# EAGLE schematic Hauptplatine (EAGLE 7.1.0)
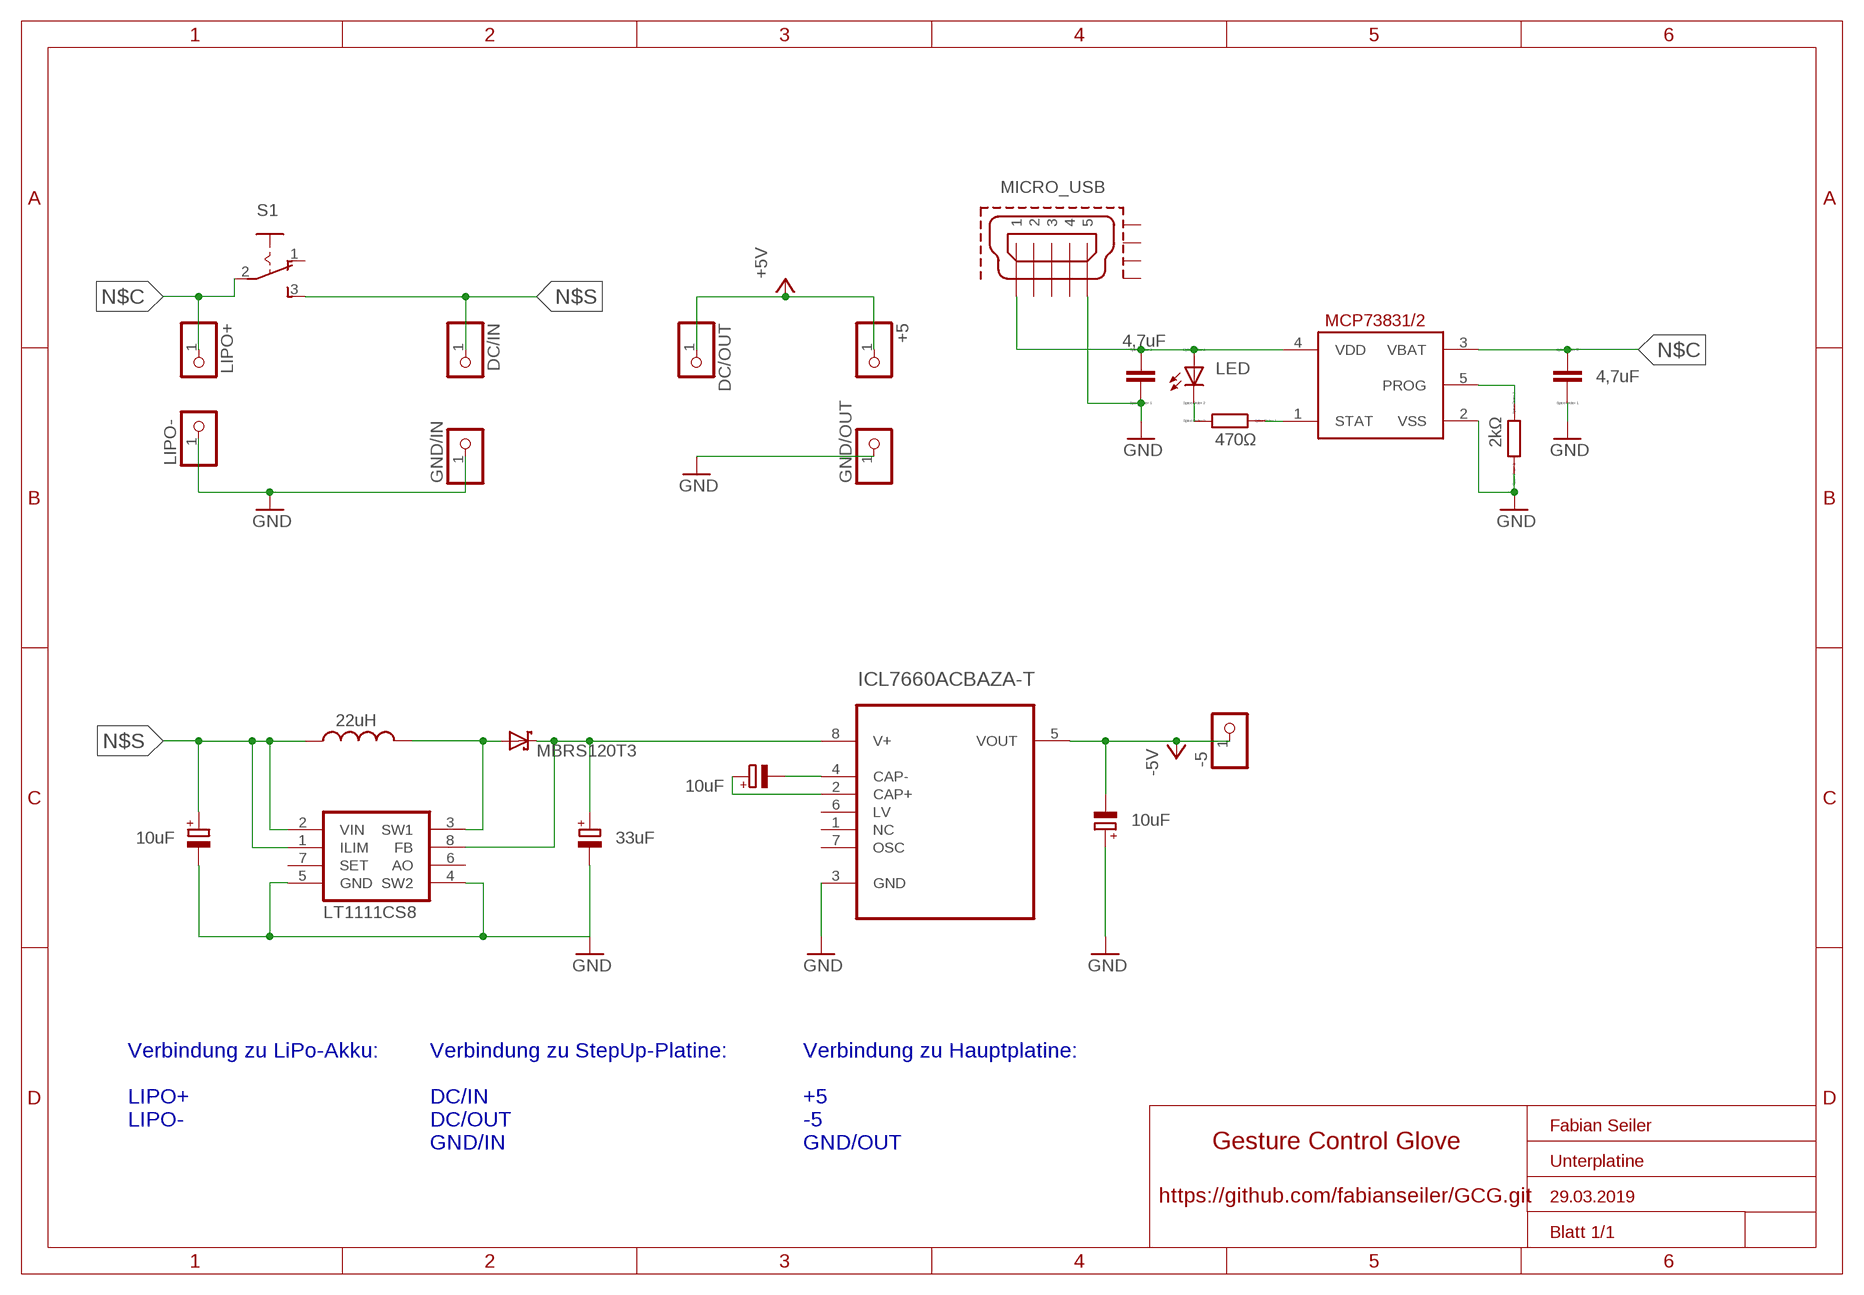
[diagram p0: schematic, sheet 1]

## Parts
+5  PINHD-1X1CB  [1X01-CLEANBIG]
-5  PINHD-1X1CB  [1X01-CLEANBIG]
C_L1  4,7uF  C-EUC0402  [C0402]
C_L2  4,7uF  C-EUC0402  [C0402]
CF3  10uF  CPOL-EU153CLV-0505  [153CLV-0505]
CF4  33uF  CPOL-EU153CLV-0505  [153CLV-0505]
CF5  10uF  CPOL-EU153CLV-0505  [153CLV-0505]
CF6  10uF  CPOL-EU153CLV-0505  [153CLV-0505]
D_PS1  MBRS120T3  [DO214AA]
DC/IN  PINHD-1X1CB  [1X01-CLEANBIG]
DC/OUT  PINHD-1X1CB  [1X01-CLEANBIG]
GND/IN  PINHD-1X1CB  [1X01-CLEANBIG]
GND/OUT  PINHD-1X1CB  [1X01-CLEANBIG]
IC1  MCP73831/OT  [SOT23-5L]
IC3  LT1111CS8  [SO08]
L-242408FPS1  22uH  L-USL2012C  [L2012C]
LED  LED_ESML0603  [LED_SML0603]
LIPO+  PINHD-1X1CB  [1X01-CLEANBIG]
LIPO-  PINHD-1X1CB  [1X01-CLEANBIG]
MICRO_USB  MICRO-USB-RECEPTACLE47589-0001  [47589-0001]
R_BMC  470Ω  R-EU_R0402  [R0402]
R_BMC2  2kΩ  R-EU_R0402  [R0402]
S1  255SB  [255SB]
U1  ICL7660ACBAZA-T  [SOIC127P600X175-8N]

## Nets
+5V: +5.1 DC/OUT.1
-5V: -5.1 CF6.- U1.5(VOUT)
GND: C_L1.1 C_L2.1 CF3.- CF4.- CF6.+ GND/IN.1 GND/OUT.1 IC1.2(VSS) IC3.4(SW2) IC3.5(GND) LIPO-.1 MICRO_USB.5 R_BMC2.1 U1.3(GND)
N$3: CF5.- U1.4(CAP-)
N$4: CF5.+ U1.2(CAP+)
N$24: C_L1.2 IC1.4(VDD) LED.A MICRO_USB.1
N$25: LED.C R_BMC.2
N$26: IC1.1(STAT) R_BMC.1
N$28: IC1.5(PROG) R_BMC2.2
N$69: D_PS1.A IC3.3(SW1) L-242408FPS1.2
N$70: CF4.+ D_PS1.C IC3.8(FB) U1.8(V+)
N$C: C_L2.2 IC1.3(VBAT) LIPO+.1 S1.2(P)
N$S: CF3.+ DC/IN.1 IC3.1(ILIM) IC3.2(VIN) L-242408FPS1.1 S1.3(S)
Unconnected: IC3.6(AO) IC3.7(SET) MICRO_USB.2 MICRO_USB.3 MICRO_USB.4 MICRO_USB.CASING1(GND1) MICRO_USB.CASING2(GND2) MICRO_USB.CASING3(GND3) MICRO_USB.CASING4(GND4) S1.1(O) U1.1(NC) U1.6(LV) U1.7(OSC)

## Notes on the sheet
- Fabian Seiler
- Verbindung zu LiPo-Akku:
  
  LIPO+
  LIPO-
- Verbindung zu StepUp-Platine:
  
  DC/IN                  
  DC/OUT
  GND/IN
- Verbindung zu Hauptplatine:
  
  +5
  -5
  GND/OUT
- Gesture Control Glove
- Unterplatine
- https://github.com/fabianseiler/GCG.git | 29.03.2019
- Blatt 1/1

## Library data of the parts
+5 -5 DC/IN DC/OUT GND/IN GND/OUT LIPO+ LIPO- = adafruit:PINHD-1X1: Pin header 1x1 for 0.1" spacing With round pins
C_L1 C_L2 = resistor:C-EU: CAPACITOR, European symbol; SPICEPREFIX: C
CF3-CF6 = resistor:CPOL-EU: POLARIZED CAPACITOR, European symbol
D_PS1 = mbrs120t3:MBRS120T3: MBRS120T3 Surface Mount Schottky Power Rectifier Reichelt: MBRS 120 SMD
IC1 = adafruit:MCP73831: MCP73831/2 Miniature Single-Cell, Fully Integrated Li-Ion, Li-Polymer Charge Management Controllers. Nice and small simple lipoly charge controller, with adjustable current and status output (LED) http://www.ladyada.net/library/pcb/eaglelibrary.html
IC3 = linear-technology-2:LT1111*: Micropower DC/DC Converter Adjustable and Fixed 5V, 12V
L-242408FPS1 = resistor:L-US: INDUCTOR, American symbol
LED = eagle-ltspice:LED_E: LED Source: http://www.osram.convergy.de Source: www.luxeon.com Source: www.kingbright.com; SPICEMODEL: NONE; SPICEPREFIX: D; SPICETYPE: diode
MICRO_USB = con-molex-usb:MICRO-USB-RECEPTACLE: MICRO USB RECEPTACLES Micro-USB Receptacles, SMT, Lead-Free from MOLEX <http://www.molex.com/>. (C) 2014 Tomasz Boleslaw CEDRO, cederom@tlen.pl, http://www.tomek.cedro.info. Version 0.1 (2014-01-17): Initial release. Version 0.2 (2014-02-06): Updated 47589-0001 footprint pins/pads/milling. Following devices are included: 1. 47589-0001 Micro-USB AB Receptacle, Bottom Mount, SMT, Lead-Free <http://www.molex.com/molex/products/datasheet.jsp?part=active/0475890001_IO_CONNECTORS.xml> (Technical Drawing <http://www.molex.com/pdm_docs/sd/475890001_sd.pdf>).
R_BMC R_BMC2 = resistor:R-EU_: RESISTOR, European symbol; SPICEPREFIX: R
S1 = switch:255SB: SLIDING SWITCH Distributor Buerklin, 11G810
U1 = ICL7660ACBAZA-T:ICL7660ACBAZA-T: CMOS VOLTAGE CONVERTER; DESCRIPTION: Voltage Regulators - Switching Regulators W/ANNEAL CMOS VAGE CNVRTR COM TAPE&E RoHS: Com; DIGI-KEY_PART_NUMBER: ICL7660ACBAZA-TCT-ND; DIGI-KEY_PURCHASE_URL: https://www.digikey.com/product-detail/en/renesas-electronics-america-inc/ICL7660ACBAZA-T/ICL7660ACBAZA-TCT-ND/1033961?utm_source=snapeda&utm_medium=aggregator&utm_campaign=symbol; MF: Renesas Electronics; MP: ICL7660ACBAZA-T; PACKAGE: SOIC-8 Intersil